# Altium project Panel 1.PrjPcb
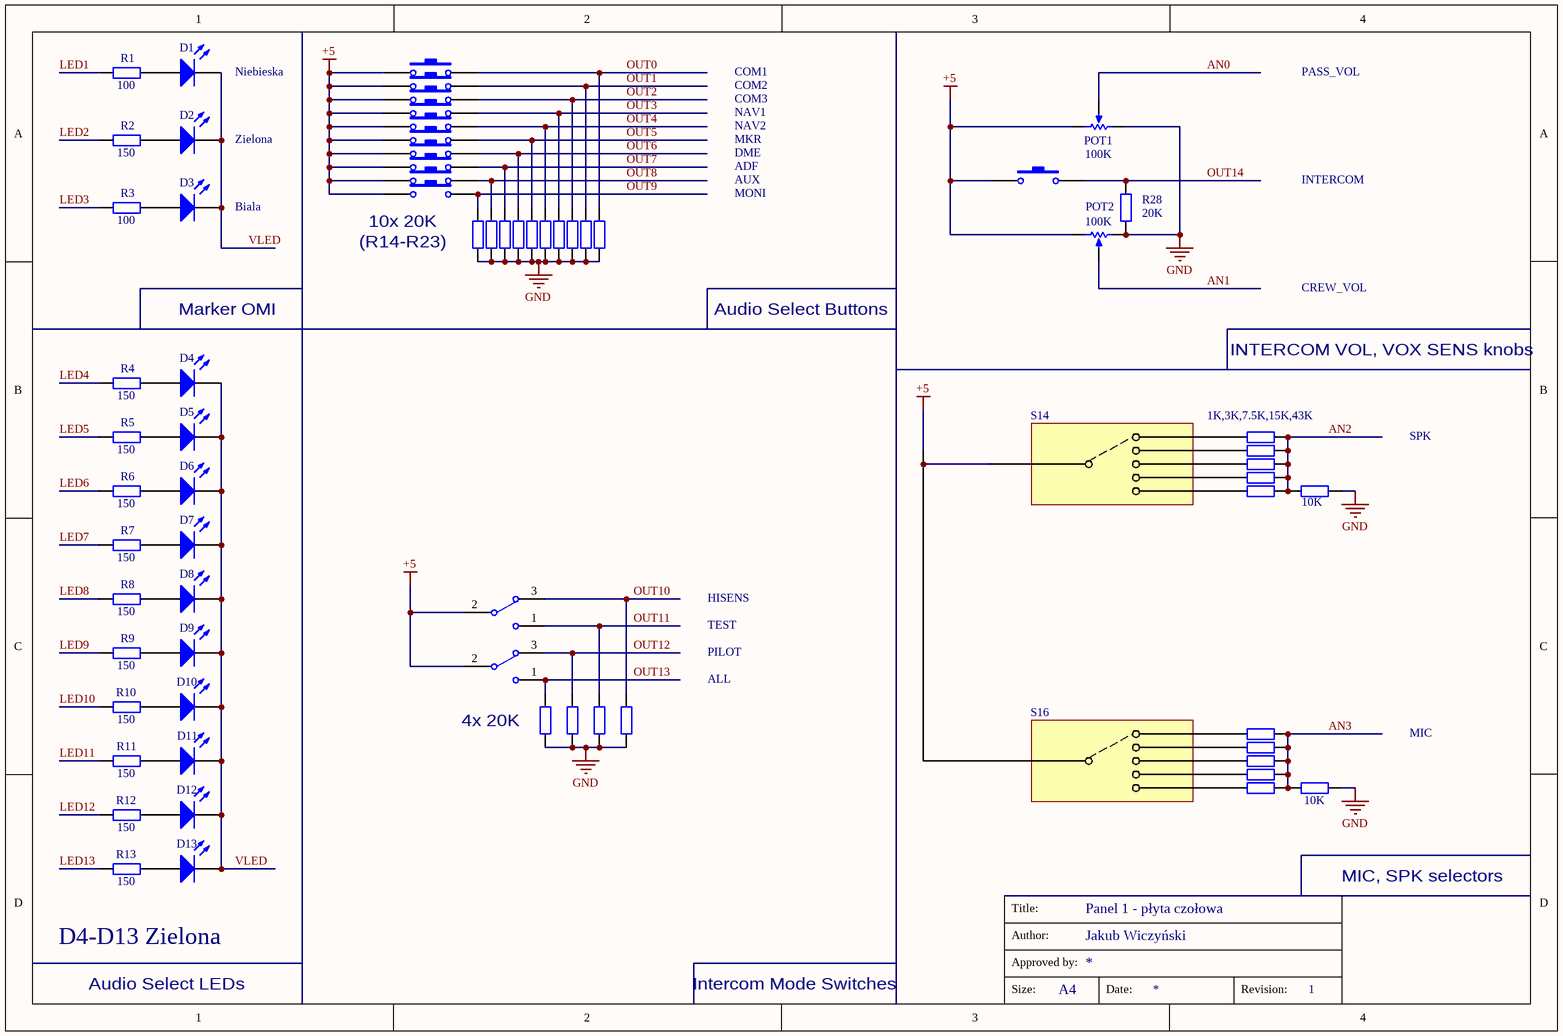
[diagram p0: Panel.SchDoc]
5 sheets, 124 parts. Net scope: global (net labels, ports and power ports of the same name join across sheets).
Board file: Panel 1.PcbDoc
Sheets:
  Panel.SchDoc
  Driving.SchDoc
  PISO.SchDoc
  SIPO.SchDoc
  sterownik.SchDoc

## Sheet Panel.SchDoc: Panel 1 - płyta czołowa
size A4; Author: Jakub Wiczyński; Revision: 1

### Parts
D1  http://www.tme.eu/pl/details/of-smd3216b/diody-led-smd-kolorowe/optoflash/  [Dioda SMD 1206 Niebieska]  (value not drawn)
D2  http://www.tme.eu/pl/details/of-smd3216yg-rv/diody-led-smd-kolorowe/optoflash/  [Dioda SMD 1206 Zielona]  (value not drawn)
D3  http://www.tme.eu/pl/details/ltw-150tk/diody-led-smd-biale/liteon/  [Dioda SMD 1206 Biala]  (value not drawn)
D4  http://www.tme.eu/pl/details/of-smd3216yg-rv/diody-led-smd-kolorowe/optoflash/  [Dioda SMD 1206 Zielona]  (value not drawn)
D5  http://www.tme.eu/pl/details/of-smd3216yg-rv/diody-led-smd-kolorowe/optoflash/  [Dioda SMD 1206 Zielona]  (value not drawn)
D6  http://www.tme.eu/pl/details/of-smd3216yg-rv/diody-led-smd-kolorowe/optoflash/  [Dioda SMD 1206 Zielona]  (value not drawn)
D7  http://www.tme.eu/pl/details/of-smd3216yg-rv/diody-led-smd-kolorowe/optoflash/  [Dioda SMD 1206 Zielona]  (value not drawn)
D8  http://www.tme.eu/pl/details/of-smd3216yg-rv/diody-led-smd-kolorowe/optoflash/  [Dioda SMD 1206 Zielona]  (value not drawn)
D9  http://www.tme.eu/pl/details/of-smd3216yg-rv/diody-led-smd-kolorowe/optoflash/  [Dioda SMD 1206 Zielona]  (value not drawn)
D10  http://www.tme.eu/pl/details/of-smd3216yg-rv/diody-led-smd-kolorowe/optoflash/  [Dioda SMD 1206 Zielona]  (value not drawn)
D11  http://www.tme.eu/pl/details/of-smd3216yg-rv/diody-led-smd-kolorowe/optoflash/  [Dioda SMD 1206 Zielona]  (value not drawn)
D12  http://www.tme.eu/pl/details/of-smd3216yg-rv/diody-led-smd-kolorowe/optoflash/  [Dioda SMD 1206 Zielona]  (value not drawn)
D13  http://www.tme.eu/pl/details/of-smd3216yg-rv/diody-led-smd-kolorowe/optoflash/  [Dioda SMD 1206 Zielona]  (value not drawn)
POT1  value 100K  [Potentiometer]  (hidden comment: http://www.tme.eu/pl/details/pcw1j-c24-bab104l/potencjometry-jednoobrz-przew-plastiku/bourns/)
POT2  value 100K  [Potentiometer]  (hidden comment: http://www.tme.eu/pl/details/pcw1j-c24-bab104l/potencjometry-jednoobrz-przew-plastiku/bourns/)
R1  value 100  [C1206]  (hidden comment: http://www.tme.eu/pl/details/crcw1206100rfktabc/rezystory-smd-1206/vishay/)
R2  value 150  [C1206]  (hidden comment: http://www.tme.eu/pl/details/crcw1206150rfktabc/rezystory-smd-1206/vishay/)
R3  value 100  [C1206]  (hidden comment: http://www.tme.eu/pl/details/crcw1206100rfktabc/rezystory-smd-1206/vishay/)
R4  value 150  [C1206]  (hidden comment: http://www.tme.eu/pl/details/crcw1206150rfktabc/rezystory-smd-1206/vishay/)
R5  value 150  [C1206]  (hidden comment: http://www.tme.eu/pl/details/crcw1206150rfktabc/rezystory-smd-1206/vishay/)
R6  value 150  [C1206]  (hidden comment: http://www.tme.eu/pl/details/crcw1206150rfktabc/rezystory-smd-1206/vishay/)
R7  value 150  [C1206]  (hidden comment: http://www.tme.eu/pl/details/crcw1206150rfktabc/rezystory-smd-1206/vishay/)
R8  value 150  [C1206]  (hidden comment: http://www.tme.eu/pl/details/crcw1206150rfktabc/rezystory-smd-1206/vishay/)
R9  value 150  [C1206]  (hidden comment: http://www.tme.eu/pl/details/crcw1206150rfktabc/rezystory-smd-1206/vishay/)
R10  value 150  [C1206]  (hidden comment: http://www.tme.eu/pl/details/crcw1206150rfktabc/rezystory-smd-1206/vishay/)
R11  value 150  [C1206]  (hidden comment: http://www.tme.eu/pl/details/crcw1206150rfktabc/rezystory-smd-1206/vishay/)
R12  value 150  [C1206]  (hidden comment: http://www.tme.eu/pl/details/crcw1206150rfktabc/rezystory-smd-1206/vishay/)
R13  value 150  [C1206]  (hidden comment: http://www.tme.eu/pl/details/crcw1206150rfktabc/rezystory-smd-1206/vishay/)
R14  http://www.tme.eu/pl/details/crcw120620k0fktabc/rezystory-smd-1206/vishay/  [C1206]  (value not drawn)
R15  http://www.tme.eu/pl/details/crcw120620k0fktabc/rezystory-smd-1206/vishay/  [C1206]  (value not drawn)
R16  http://www.tme.eu/pl/details/crcw120620k0fktabc/rezystory-smd-1206/vishay/  [C1206]  (value not drawn)
R17  http://www.tme.eu/pl/details/crcw120620k0fktabc/rezystory-smd-1206/vishay/  [C1206]  (value not drawn)
R18  http://www.tme.eu/pl/details/crcw120620k0fktabc/rezystory-smd-1206/vishay/  [C1206]  (value not drawn)
R19  http://www.tme.eu/pl/details/crcw120620k0fktabc/rezystory-smd-1206/vishay/  [C1206]  (value not drawn)
R20  http://www.tme.eu/pl/details/crcw120620k0fktabc/rezystory-smd-1206/vishay/  [C1206]  (value not drawn)
R21  http://www.tme.eu/pl/details/crcw120620k0fktabc/rezystory-smd-1206/vishay/  [C1206]  (value not drawn)
R22  http://www.tme.eu/pl/details/crcw120620k0fktabc/rezystory-smd-1206/vishay/  [C1206]  (value not drawn)
R23  http://www.tme.eu/pl/details/crcw120620k0fktabc/rezystory-smd-1206/vishay/  [C1206]  (value not drawn)
R24  http://www.tme.eu/pl/details/crcw120620k0fktabc/rezystory-smd-1206/vishay/  [C1206]  (value not drawn)
R25  http://www.tme.eu/pl/details/crcw120620k0fktabc/rezystory-smd-1206/vishay/  [C1206]  (value not drawn)
R26  http://www.tme.eu/pl/details/crcw120620k0fktabc/rezystory-smd-1206/vishay/  [C1206]  (value not drawn)
R27  http://www.tme.eu/pl/details/crcw120620k0fktabc/rezystory-smd-1206/vishay/  [C1206]  (value not drawn)
R28  value 20K  [C1206]  (hidden comment: http://www.tme.eu/pl/details/crcw120620k0fktabc/rezystory-smd-1206/vishay/)
R29  http://www.tme.eu/pl/details/crcw12061k00fkea/rezystory-smd-1206/vishay/  [C1206]  (value not drawn)
R30  http://www.tme.eu/pl/details/crcw12063k00fktabc/rezystory-smd-1206/vishay/  [C1206]  (value not drawn)
R31  http://www.tme.eu/pl/details/crcw12067k50fktabc/rezystory-smd-1206/vishay/  [C1206]  (value not drawn)
R32  http://www.tme.eu/pl/details/crcw120615k0jntabc/rezystory-smd-1206/vishay/  [C1206]  (value not drawn)
R33  http://www.tme.eu/pl/details/rc1206jr-0743k/rezystory-smd-1206/yageo/rc1206jr-0743kl/  [C1206]  (value not drawn)
R34  value 10K  [C1206]  (hidden comment: http://www.tme.eu/pl/details/crcw120610k0jntabc/rezystory-smd-1206/vishay/)
R36  http://www.tme.eu/pl/details/crcw12061k00fkea/rezystory-smd-1206/vishay/  [C1206]  (value not drawn)
R37  http://www.tme.eu/pl/details/crcw12063k00fktabc/rezystory-smd-1206/vishay/  [C1206]  (value not drawn)
R38  http://www.tme.eu/pl/details/crcw12067k50fktabc/rezystory-smd-1206/vishay/  [C1206]  (value not drawn)
R39  http://www.tme.eu/pl/details/crcw120615k0jntabc/rezystory-smd-1206/vishay/  [C1206]  (value not drawn)
R40  http://www.tme.eu/pl/details/rc1206jr-0743k/rezystory-smd-1206/yageo/rc1206jr-0743kl/  [C1206]  (value not drawn)
R41  value 10K  [C1206]  (hidden comment: http://www.tme.eu/pl/details/crcw120610k0jntabc/rezystory-smd-1206/vishay/)
S1  http://www.tme.eu/pl/details/1301.9315/mikroprzelaczniki-tact-pcb/schurter/  [Microswitch_SMD]  (value not drawn)
S2  http://www.tme.eu/pl/details/1301.9315/mikroprzelaczniki-tact-pcb/schurter/  [Microswitch_SMD]  (value not drawn)
S3  http://www.tme.eu/pl/details/1301.9315/mikroprzelaczniki-tact-pcb/schurter/  [Microswitch_SMD]  (value not drawn)
S4  http://www.tme.eu/pl/details/1301.9315/mikroprzelaczniki-tact-pcb/schurter/  [Microswitch_SMD]  (value not drawn)
S5  http://www.tme.eu/pl/details/1301.9315/mikroprzelaczniki-tact-pcb/schurter/  [Microswitch_SMD]  (value not drawn)
S6  http://www.tme.eu/pl/details/1301.9315/mikroprzelaczniki-tact-pcb/schurter/  [Microswitch_SMD]  (value not drawn)
S7  http://www.tme.eu/pl/details/1301.9315/mikroprzelaczniki-tact-pcb/schurter/  [Microswitch_SMD]  (value not drawn)
S8  http://www.tme.eu/pl/details/1301.9315/mikroprzelaczniki-tact-pcb/schurter/  [Microswitch_SMD]  (value not drawn)
S9  http://www.tme.eu/pl/details/1301.9315/mikroprzelaczniki-tact-pcb/schurter/  [Microswitch_SMD]  (value not drawn)
S10  http://www.tme.eu/pl/details/1301.9315/mikroprzelaczniki-tact-pcb/schurter/  [Microswitch_SMD]  (value not drawn)
S11  http://www.tme.eu/pl/details/1ms3t1b1m1qe/przelaczniki-dzwigniowe/ninigi/  [3POS SWITCH]  (value not drawn)
S12  http://www.tme.eu/pl/details/1ms3t1b1m1qe/przelaczniki-dzwigniowe/ninigi/  [3POS SWITCH]  (value not drawn)
S13  http://www.tme.eu/pl/details/1301.9315/mikroprzelaczniki-tact-pcb/schurter/  [Microswitch_SMD]  (value not drawn)
S14  http://www.tme.eu/pl/details/sr2611515fn/przelaczniki-obrotowe/ninigi/  [ROT SW]  (value not drawn)
S16  http://www.tme.eu/pl/details/sr2611515fn/przelaczniki-obrotowe/ninigi/  [ROT SW]  (value not drawn)

### Nets
+5: POT1.2(BOT) POT2.1(TOP) S1.1 S2.1 S3.1 S4.1 S5.1 S6.1 S7.1 S8.1 S9.1 S10.1 S11.2 S12.2 S13.1 S14.1 S16.1
GND: POT1.1(TOP) POT2.2(BOT) R14.1 R15.1 R16.1 R17.1 R18.1 R19.1 R20.1 R21.1 R22.1 R23.1 R24.1 R25.1 R26.1 R27.1 R28.2 R34.1 R41.1
AN0: POT1.3(TAP)
AN1: POT2.3(TAP)
AN2: R29.2 R30.2 R31.2 R32.2 R33.2 R34.2
AN3: R36.2 R37.2 R38.2 R39.2 R40.2 R41.2
LED1: R1.1
LED2: R2.1
LED3: R3.1
LED4: R4.1
LED5: R5.1
LED6: R6.1
LED7: R7.1
LED8: R8.1
LED9: R9.1
LED10: R10.1
LED11: R11.1
LED12: R12.1
LED13: R13.1
OUT0: R23.2 S1.2
OUT1: R22.2 S2.2
OUT2: R21.2 S3.2
OUT3: R20.2 S4.2
OUT4: R19.2 S5.2
OUT5: R18.2 S6.2
OUT6: R17.2 S7.2
OUT7: R16.2 S8.2
OUT8: R15.2 S9.2
OUT9: R14.2 S10.2
OUT10: R27.2 S11.3
OUT11: R26.2 S11.1
OUT12: R25.2 S12.3
OUT13: R24.2 S12.1
OUT14: R28.1 S13.2
VLED: D1.2(K) D2.2(K) D3.2(K) D4.2(K) D5.2(K) D6.2(K) D7.2(K) D8.2(K) D9.2(K) D10.2(K) D11.2(K) D12.2(K) D13.2(K)
NetD1_1: D1.1(A) R1.2
NetD2_1: D2.1(A) R2.2
NetD3_1: D3.1(A) R3.2
NetD4_1: D4.1(A) R4.2
NetD5_1: D5.1(A) R5.2
NetD6_1: D6.1(A) R6.2
NetD7_1: D7.1(A) R7.2
NetD8_1: D8.1(A) R8.2
NetD9_1: D9.1(A) R9.2
NetD10_1: D10.1(A) R10.2
NetD11_1: D11.1(A) R11.2
NetD12_1: D12.1(A) R12.2
NetD13_1: D13.1(A) R13.2
NetR29_1: R29.1 S14.2
NetR30_1: R30.1 S14.3
NetR31_1: R31.1 S14.4
NetR32_1: R32.1 S14.5
NetR33_1: R33.1 S14.6
NetR36_1: R36.1 S16.2
NetR37_1: R37.1 S16.3
NetR38_1: R38.1 S16.4
NetR39_1: R39.1 S16.5
NetR40_1: R40.1 S16.6

### Notes on the sheet
- (near D1) Niebieska
- COM1
- COM2
- COM3
- NAV1
- PASS_VOL
- (near D2) Zielona
- NAV2
- MKR
- DME
- ADF
- (near D3) Biala
- (near S10) 10x 20K
- (R14-R23)
- AUX
- MONI
- INTERCOM
- Marker OMI
- Audio Select Buttons
- CREW_VOL
- INTERCOM VOL, VOX SENS knobs
- 1K,3K,7.5K,15K,43K
- SPK
- HISENS
- TEST
- PILOT
- 4x 20K
- ALL
- MIC
- MIC, SPK selectors
- D4-D13 Zielona
- Audio Select LEDs
- Intercom Mode Switches
- Title:
- Author:
- Approved by:
- Size:
- A4
- Date:
- Revision:

### Library data of the parts
D1 = LED0: LED SMD Niebieska; Published: 8-Jun-2000; LatestRevisionDate: 08-Jul-2005; LatestRevisionNote: Mech Layer 1 removed.; PackageReference: LED-0; Publisher: Altium Limited; PackageDescription: LED; 2 Leads
D2 D4-D13 = LED0: LED SMD Zielona; Published: 8-Jun-2000; LatestRevisionDate: 08-Jul-2005; LatestRevisionNote: Mech Layer 1 removed.; PackageReference: LED-0; Publisher: Altium Limited; PackageDescription: LED; 2 Leads
D3 = LED0: LED SMD Biala; Published: 8-Jun-2000; LatestRevisionDate: 08-Jul-2005; LatestRevisionNote: Mech Layer 1 removed.; PackageReference: LED-0; Publisher: Altium Limited; PackageDescription: LED; 2 Leads
POT1 POT2 = RPot: Potencjometr 100K; pin to pad: 1>3 2>1 3>2; Sim Note: Enter the Resistance value and the set point into parameter fields.; Set Position: 0.5; Published: 8-Jun-2000; LatestRevisionDate: 17-Jul-2002; LatestRevisionNote: Re-released for DXP Platform.; PackageReference: VR5; Publisher: Altium Limited; PackageDescription: Variable Resistor, Thru-Hole; 3 Leads
R1 R3 = Res2: 100R; Published: 8-Jun-2000; LatestRevisionDate: 17-Jul-2002; LatestRevisionNote: Re-released for DXP Platform.; PackageReference: AXIAL-0.4; Publisher: Altium Limited; PackageDescription: Axial Device, Thru-Hole; 2 Leads; 0.4 in Pin Spacing
R2 R4-R13 = Res2: 150R; Published: 8-Jun-2000; LatestRevisionDate: 17-Jul-2002; LatestRevisionNote: Re-released for DXP Platform.; PackageReference: AXIAL-0.4; Publisher: Altium Limited; PackageDescription: Axial Device, Thru-Hole; 2 Leads; 0.4 in Pin Spacing
R14-R28 = Res2: 20K; Published: 8-Jun-2000; LatestRevisionDate: 17-Jul-2002; LatestRevisionNote: Re-released for DXP Platform.; PackageReference: AXIAL-0.4; Publisher: Altium Limited; PackageDescription: Axial Device, Thru-Hole; 2 Leads; 0.4 in Pin Spacing
  R14-R27: Value: 20K
R29 R36 = Res2: 1K; Published: 8-Jun-2000; LatestRevisionDate: 17-Jul-2002; LatestRevisionNote: Re-released for DXP Platform.; PackageReference: AXIAL-0.4; Publisher: Altium Limited; PackageDescription: Axial Device, Thru-Hole; 2 Leads; 0.4 in Pin Spacing; Value: 1K
R30 R37 = Res2: 3K; Published: 8-Jun-2000; LatestRevisionDate: 17-Jul-2002; LatestRevisionNote: Re-released for DXP Platform.; PackageReference: AXIAL-0.4; Publisher: Altium Limited; PackageDescription: Axial Device, Thru-Hole; 2 Leads; 0.4 in Pin Spacing; Value: 3K
R31 R38 = Res2: 7.5K; Published: 8-Jun-2000; LatestRevisionDate: 17-Jul-2002; LatestRevisionNote: Re-released for DXP Platform.; PackageReference: AXIAL-0.4; Publisher: Altium Limited; PackageDescription: Axial Device, Thru-Hole; 2 Leads; 0.4 in Pin Spacing; Value: 7.5K
R32 R39 = Res2: 15K; Published: 8-Jun-2000; LatestRevisionDate: 17-Jul-2002; LatestRevisionNote: Re-released for DXP Platform.; PackageReference: AXIAL-0.4; Publisher: Altium Limited; PackageDescription: Axial Device, Thru-Hole; 2 Leads; 0.4 in Pin Spacing; Value: 15K
R33 R40 = Res2: 43K; Published: 8-Jun-2000; LatestRevisionDate: 17-Jul-2002; LatestRevisionNote: Re-released for DXP Platform.; PackageReference: AXIAL-0.4; Publisher: Altium Limited; PackageDescription: Axial Device, Thru-Hole; 2 Leads; 0.4 in Pin Spacing; Value: 43K
R34 R41 = Res2: 10K; Published: 8-Jun-2000; LatestRevisionDate: 17-Jul-2002; LatestRevisionNote: Re-released for DXP Platform.; PackageReference: AXIAL-0.4; Publisher: Altium Limited; PackageDescription: Axial Device, Thru-Hole; 2 Leads; 0.4 in Pin Spacing
S1-S10 S13 = SW-PB: Microswitch (SPST); pin to pad: 2>3; Published: 24-Mar-1999; LatestRevisionDate: 17-Jul-2002; LatestRevisionNote: Re-released for DXP Platform.; PackageReference: SPST-2; Publisher: Altium Limited; PackageDescription: Switch; 2 Leads
S11 S12 = SW-SPDT: Przelacznik SP3T; Published: 24-Mar-1999; LatestRevisionDate: 17-Dec-2003; LatestRevisionNote: Schematic revised, PCB Footprint replaced.; DatasheetVersion: 05-Dec-2000; PackageReference: TL36WW15050; Publisher: Altium Limited; PackageDescription: Switch; 4 Leads; ComponentLink1Description: Manufacturer Link; ComponentLink1URL: http://www.apem.com
S14 S16 = 5SW: Przelacznik obrotowy 5-pozycyjny; pin to pad: 1>A 2>1 3>2 4>3 5>4 6>5

## Sheet Driving.SchDoc: Sterowanie LED
size A4; Author: Jakub Wiczynski; Organization: Simle; Revision: 1; ProjectName: Symulator
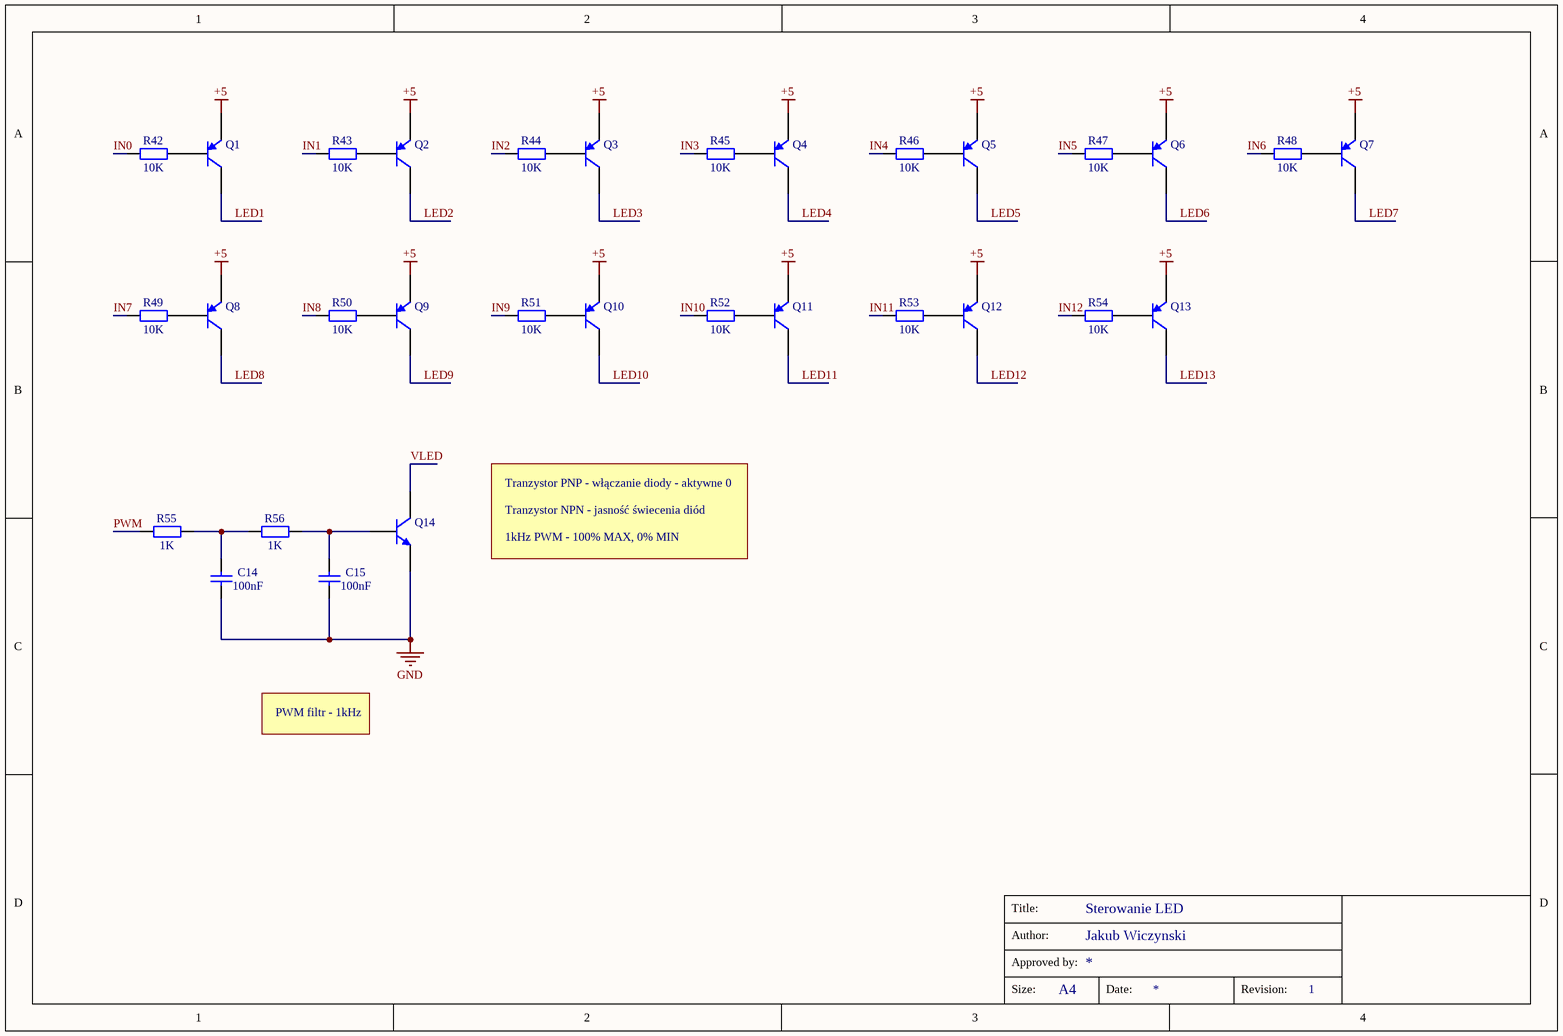
[diagram p1: Driving.SchDoc]

### Parts
C14  value 100nF  [C1206]  (hidden comment: http://www.tme.eu/pl/details/12061c104kat2a/kondensatory-mlcc-smd-1206/avx/)
C15  value 100nF  [C1206]  (hidden comment: http://www.tme.eu/pl/details/12061c104kat2a/kondensatory-mlcc-smd-1206/avx/)
Q1  http://www.tme.eu/pl/details/bc856a/tranzystory-pnp-smd/nexperia/bc856a215/  [SOT-23B_N]  (value not drawn)
Q2  http://www.tme.eu/pl/details/bc856a/tranzystory-pnp-smd/nexperia/bc856a215/  [SOT-23B_N]  (value not drawn)
Q3  http://www.tme.eu/pl/details/bc856a/tranzystory-pnp-smd/nexperia/bc856a215/  [SOT-23B_N]  (value not drawn)
Q4  http://www.tme.eu/pl/details/bc856a/tranzystory-pnp-smd/nexperia/bc856a215/  [SOT-23B_N]  (value not drawn)
Q5  http://www.tme.eu/pl/details/bc856a/tranzystory-pnp-smd/nexperia/bc856a215/  [SOT-23B_N]  (value not drawn)
Q6  http://www.tme.eu/pl/details/bc856a/tranzystory-pnp-smd/nexperia/bc856a215/  [SOT-23B_N]  (value not drawn)
Q7  http://www.tme.eu/pl/details/bc856a/tranzystory-pnp-smd/nexperia/bc856a215/  [SOT-23B_N]  (value not drawn)
Q8  http://www.tme.eu/pl/details/bc856a/tranzystory-pnp-smd/nexperia/bc856a215/  [SOT-23B_N]  (value not drawn)
Q9  http://www.tme.eu/pl/details/bc856a/tranzystory-pnp-smd/nexperia/bc856a215/  [SOT-23B_N]  (value not drawn)
Q10  http://www.tme.eu/pl/details/bc856a/tranzystory-pnp-smd/nexperia/bc856a215/  [SOT-23B_N]  (value not drawn)
Q11  http://www.tme.eu/pl/details/bc856a/tranzystory-pnp-smd/nexperia/bc856a215/  [SOT-23B_N]  (value not drawn)
Q12  http://www.tme.eu/pl/details/bc856a/tranzystory-pnp-smd/nexperia/bc856a215/  [SOT-23B_N]  (value not drawn)
Q13  http://www.tme.eu/pl/details/bc856a/tranzystory-pnp-smd/nexperia/bc856a215/  [SOT-23B_N]  (value not drawn)
Q14  http://www.tme.eu/pl/details/bc817-16.215/tranzystory-npn-smd/nexperia/  [SOT-23B_N]  (value not drawn)
R42  value 10K  [C1206]  (hidden comment: http://www.tme.eu/pl/details/crcw120610k0jntabc/rezystory-smd-1206/vishay/)
R43  value 10K  [C1206]  (hidden comment: http://www.tme.eu/pl/details/crcw120610k0jntabc/rezystory-smd-1206/vishay/)
R44  value 10K  [C1206]  (hidden comment: http://www.tme.eu/pl/details/crcw120610k0jntabc/rezystory-smd-1206/vishay/)
R45  value 10K  [C1206]  (hidden comment: http://www.tme.eu/pl/details/crcw120610k0jntabc/rezystory-smd-1206/vishay/)
R46  value 10K  [C1206]  (hidden comment: http://www.tme.eu/pl/details/crcw120610k0jntabc/rezystory-smd-1206/vishay/)
R47  value 10K  [C1206]  (hidden comment: http://www.tme.eu/pl/details/crcw120610k0jntabc/rezystory-smd-1206/vishay/)
R48  value 10K  [C1206]  (hidden comment: http://www.tme.eu/pl/details/crcw120610k0jntabc/rezystory-smd-1206/vishay/)
R49  value 10K  [C1206]  (hidden comment: http://www.tme.eu/pl/details/crcw120610k0jntabc/rezystory-smd-1206/vishay/)
R50  value 10K  [C1206]  (hidden comment: http://www.tme.eu/pl/details/crcw120610k0jntabc/rezystory-smd-1206/vishay/)
R51  value 10K  [C1206]  (hidden comment: http://www.tme.eu/pl/details/crcw120610k0jntabc/rezystory-smd-1206/vishay/)
R52  value 10K  [C1206]  (hidden comment: http://www.tme.eu/pl/details/crcw120610k0jntabc/rezystory-smd-1206/vishay/)
R53  value 10K  [C1206]  (hidden comment: http://www.tme.eu/pl/details/crcw120610k0jntabc/rezystory-smd-1206/vishay/)
R54  value 10K  [C1206]  (hidden comment: http://www.tme.eu/pl/details/crcw120610k0jntabc/rezystory-smd-1206/vishay/)
R55  value 1K  [C1206]  (hidden comment: http://www.tme.eu/pl/details/crcw12061k00fkea/rezystory-smd-1206/vishay/)
R56  value 1K  [C1206]  (hidden comment: http://www.tme.eu/pl/details/crcw12061k00fkea/rezystory-smd-1206/vishay/)

### Nets
+5: Q1.3(E) Q2.3(E) Q3.3(E) Q4.3(E) Q5.3(E) Q6.3(E) Q7.3(E) Q8.3(E) Q9.3(E) Q10.3(E) Q11.3(E) Q12.3(E) Q13.3(E)
GND: C14.1 C15.1 Q14.3(E)
IN0: R42.1
IN1: R43.1
IN2: R44.1
IN3: R45.1
IN4: R46.1
IN5: R47.1
IN6: R48.1
IN7: R49.1
IN8: R50.1
IN9: R51.1
IN10: R52.1
IN11: R53.1
IN12: R54.1
LED1: Q1.1(C)
LED2: Q2.1(C)
LED3: Q3.1(C)
LED4: Q4.1(C)
LED5: Q5.1(C)
LED6: Q6.1(C)
LED7: Q7.1(C)
LED8: Q8.1(C)
LED9: Q9.1(C)
LED10: Q10.1(C)
LED11: Q11.1(C)
LED12: Q12.1(C)
LED13: Q13.1(C)
PWM: R55.1
VLED: Q14.1(C)
NetC14_2: C14.2 R55.2 R56.1
NetC15_2: C15.2 Q14.2(B) R56.2
NetQ1_2: Q1.2(B) R42.2
NetQ2_2: Q2.2(B) R43.2
NetQ3_2: Q3.2(B) R44.2
NetQ4_2: Q4.2(B) R45.2
NetQ5_2: Q5.2(B) R46.2
NetQ6_2: Q6.2(B) R47.2
NetQ7_2: Q7.2(B) R48.2
NetQ8_2: Q8.2(B) R49.2
NetQ9_2: Q9.2(B) R50.2
NetQ10_2: Q10.2(B) R51.2
NetQ11_2: Q11.2(B) R52.2
NetQ12_2: Q12.2(B) R53.2
NetQ13_2: Q13.2(B) R54.2

### Notes on the sheet
- Tranzystor PNP - włączanie diody - aktywne 0
- Tranzystor NPN - jasność świecenia diód
- 1kHz PWM - 100% MAX, 0% MIN
- PWM filtr - 1kHz
- Title:
- Author:
- Approved by:
- Size:
- A4
- Date:
- Revision:

### Library data of the parts
C14 C15 = Cap: 100nF; Published: 8-Jun-2000; LatestRevisionDate: 17-Jul-2002; LatestRevisionNote: Re-released for DXP Platform.; PackageReference: RAD-0.3; Publisher: Altium Limited; PackageDescription: Radial Cap, Thru-Hole; 2 Leads; 0.3 in Pin Spacing
Q1-Q13 = PNP: PNP 100mA; Published: 8-Jun-2000; LatestRevisionDate: 29-May-2009; LatestRevisionNote: IPC-7351 Footprint Added.; PackageVersion: Aug-1999; PackageReference: SOT-23B; Publisher: Altium Limited; PackageDescription: 3-Pin SOT-23 Package 0.95 mm Pitch, 2.4 mm Lead Span
Q14 = NPN: NPN 500mA; Published: 8-Jun-2000; LatestRevisionDate: 17-Jul-2002; LatestRevisionNote: Re-released for DXP Platform.; PackageReference: TO-226-AA; Publisher: Altium Limited; PackageDescription: TO, Flat Index; 3 In-Line, Axial Leads; Body Dia. 4.8mm; Leads 0.55 x 0.51 mm (max); Code_JEDEC: TO-226-AA
R42-R54 = Res2: 10K; Published: 8-Jun-2000; LatestRevisionDate: 17-Jul-2002; LatestRevisionNote: Re-released for DXP Platform.; PackageReference: AXIAL-0.4; Publisher: Altium Limited; PackageDescription: Axial Device, Thru-Hole; 2 Leads; 0.4 in Pin Spacing
R55 R56 = Res2: 1K; Published: 8-Jun-2000; LatestRevisionDate: 17-Jul-2002; LatestRevisionNote: Re-released for DXP Platform.; PackageReference: AXIAL-0.4; Publisher: Altium Limited; PackageDescription: Axial Device, Thru-Hole; 2 Leads; 0.4 in Pin Spacing

## Sheet PISO.SchDoc: Rejestry PISO
size A4; Author: Jakub Wiczynski; Revision: 1
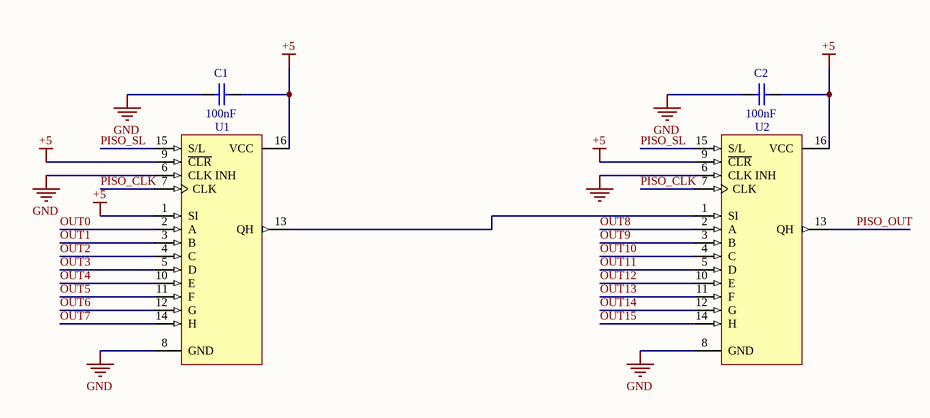
[diagram p2: PISO.SchDoc]

### Parts
C1  value 100nF  [C1206]  (hidden comment: http://www.tme.eu/pl/details/12061c104kat2a/kondensatory-mlcc-smd-1206/avx/)
C2  value 100nF  [C1206]  (hidden comment: http://www.tme.eu/pl/details/12061c104kat2a/kondensatory-mlcc-smd-1206/avx/)
U1  http://www.tme.eu/pl/details/sn74hc166d/rejestry-przesuwne/texas-instruments/  [D016_N]  (value not drawn)
U2  http://www.tme.eu/pl/details/sn74hc166d/rejestry-przesuwne/texas-instruments/  [D016_N]  (value not drawn)

### Nets
+5: C1.2 C2.2 U1.1(SI) U1.9(~{CLR}) U1.16(VCC) U2.9(~{CLR}) U2.16(VCC)
GND: C1.1 C2.1 U1.6(CLK_INH) U1.8(GND) U2.6(CLK_INH) U2.8(GND)
OUT0: U1.2(A)
OUT1: U1.3(B)
OUT2: U1.4(C)
OUT3: U1.5(D)
OUT4: U1.10(E)
OUT5: U1.11(F)
OUT6: U1.12(G)
OUT7: U1.14(H)
OUT8: U2.2(A)
OUT9: U2.3(B)
OUT10: U2.4(C)
OUT11: U2.5(D)
OUT12: U2.10(E)
OUT13: U2.11(F)
OUT14: U2.12(G)
OUT15: U2.14(H)
PISO_CLK: U1.7(CLK) U2.7(CLK)
PISO_OUT: U2.13(QH)
PISO_SL: U1.15(S/L) U2.15(S/L)
NetU1_13: U1.13(QH) U2.1(SI)

### Notes on the sheet
- Title:
- Author:
- Approved by:
- Size:
- A4
- Date:
- Revision:

### Library data of the parts
C1 C2 = Cap: 100nF; Published: 8-Jun-2000; LatestRevisionDate: 17-Jul-2002; LatestRevisionNote: Re-released for DXP Platform.; PackageReference: RAD-0.3; Publisher: Altium Limited; PackageDescription: Radial Cap, Thru-Hole; 2 Leads; 0.3 in Pin Spacing
U1 U2 = SN74HC166D: SN74HC166; Published: 8-Jun-2000; LatestRevisionDate: 13-Apr-2006; LatestRevisionNote: IPC-7351 Footprint Added.; DatasheetVersion: May-1997; PackageVersion: Jan-1998; PackageReference: D016; Publisher: Altium Limited; PackageDescription: 16-Pin Small Outline Integrated Circuit 1.27 mm Pitch; Code_IPC: SOIC127P600-16; ComponentLink1Description: Manufacturer Link; ComponentLink1URL: http://www.ti.com/; ComponentLink2Description: Datasheet; ComponentLink2URL: http://www-s.ti.com/sc/ds/sn74hc166.pdf

## Sheet SIPO.SchDoc: Rejestry SIPO
size A4; Author: Jakub Wiczynski; Revision: 1
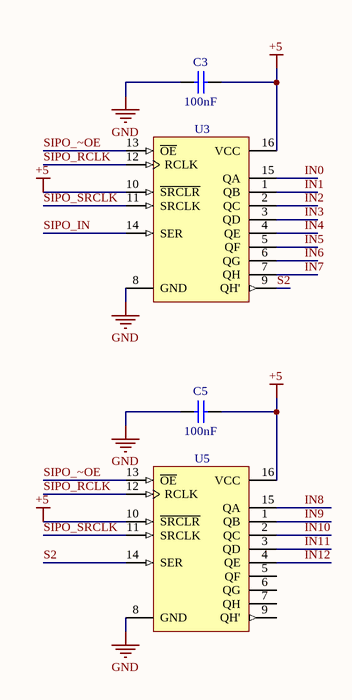
[diagram p3: SIPO.SchDoc]

### Parts
C3  value 100nF  [C1206]  (hidden comment: http://www.tme.eu/pl/details/12061c104kat2a/kondensatory-mlcc-smd-1206/avx/)
C5  value 100nF  [C1206]  (hidden comment: http://www.tme.eu/pl/details/12061c104kat2a/kondensatory-mlcc-smd-1206/avx/)
U3  http://www.tme.eu/pl/details/sn74hc595d/rejestry-przesuwne/texas-instruments/  [SOIC16_N]  (value not drawn)
U5  http://www.tme.eu/pl/details/sn74hc595d/rejestry-przesuwne/texas-instruments/  [SOIC16_N]  (value not drawn)

### Nets
+5: C3.2 C5.2 U3.10(~{SRCLR}) U3.16(VCC) U5.10(~{SRCLR}) U5.16(VCC)
GND: C3.1 C5.1 U3.8(GND) U5.8(GND)
IN0: U3.15(QA)
IN1: U3.1(QB)
IN2: U3.2(QC)
IN3: U3.3(QD)
IN4: U3.4(QE)
IN5: U3.5(QF)
IN6: U3.6(QG)
IN7: U3.7(QH)
IN8: U5.15(QA)
IN9: U5.1(QB)
IN10: U5.2(QC)
IN11: U5.3(QD)
IN12: U5.4(QE)
S2: U3.9(QH') U5.14(SER)
SIPO_IN: U3.14(SER)
SIPO_RCLK: U3.12(RCLK) U5.12(RCLK)
SIPO_SRCLK: U3.11(SRCLK) U5.11(SRCLK)
SIPO_~OE: U3.13(~{OE}) U5.13(~{OE})

Not connected (* = marked no-connect by the designer): U5 5(QF) 6(QG) 7(QH) 9(QH')

### Notes on the sheet
- Title:
- Author:
- Approved by:
- Size:
- A4
- Date:
- Revision:

### Library data of the parts
C3 C5 = Cap: 100nF; Published: 8-Jun-2000; LatestRevisionDate: 17-Jul-2002; LatestRevisionNote: Re-released for DXP Platform.; PackageReference: RAD-0.3; Publisher: Altium Limited; PackageDescription: Radial Cap, Thru-Hole; 2 Leads; 0.3 in Pin Spacing
U3 U5 = SN74HC595N: SN74HC595; Published: 8-Jun-2000; LatestRevisionDate: 04-Mar-2005; LatestRevisionNote: Stylized 3D Model Added.; DatasheetVersion: May-1997; PackageVersion: Oct-1995; PackageReference: N016; Publisher: Altium Limited; PackageDescription: DIP; 16 Leads; Row Spacing 7.62 mm; Pitch 2.54 mm; Code_JEDEC: MS-001-BB; ComponentLink1Description: Manufacturer Link; ComponentLink1URL: http://www.ti.com/; ComponentLink2Description: Datasheet; ComponentLink2URL: http://www-s.ti.com/sc/ds/sn74hc595.pdf

## Sheet sterownik.SchDoc: Sterownik panelu
size A4; Author: Jakub Wiczynski; Revision: 1
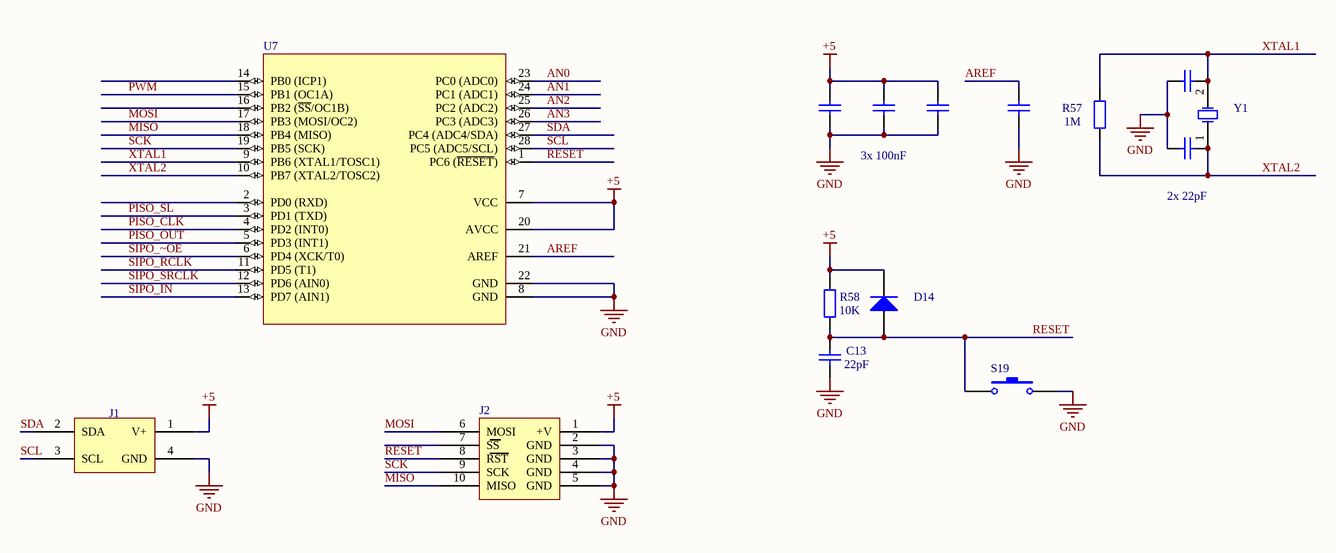
[diagram p4: sterownik.SchDoc]

### Parts
C7  http://www.tme.eu/pl/details/12061c104kat2a/kondensatory-mlcc-smd-1206/avx/  [C1206]  (value not drawn)
C8  http://www.tme.eu/pl/details/12061c104kat2a/kondensatory-mlcc-smd-1206/avx/  [C1206]  (value not drawn)
C9  http://www.tme.eu/pl/details/12061c104kat2a/kondensatory-mlcc-smd-1206/avx/  [C1206]  (value not drawn)
C10  http://www.tme.eu/pl/details/12061c104kat2a/kondensatory-mlcc-smd-1206/avx/  [C1206]  (value not drawn)
C11  http://www.tme.eu/pl/details/cl31c220jbcnnnc/kondensatory-mlcc-smd-1206/samsung/  [C1206]  (value not drawn)
C12  http://www.tme.eu/pl/details/cl31c220jbcnnnc/kondensatory-mlcc-smd-1206/samsung/  [C1206]  (value not drawn)
C13  value 22pF  [C1206]  (hidden comment: http://www.tme.eu/pl/details/cl31c220jbcnnnc/kondensatory-mlcc-smd-1206/samsung/)
D14  http://www.tme.eu/pl/details/1n4148-1206/diody-uniwersalne-smd/dc-components/cd4148w1206c/  [DIODA 1N4148]  (value not drawn)
J1  http://www.tme.eu/pl/details/p1304/zlacza-idc/tomic/  [IDC 4PIN]  (value not drawn)
J2  http://www.tme.eu/pl/details/09185106324/zlacza-idc/harting/  [IDC 10PIN]  (value not drawn)
R57  value 1M  [C1206]  (hidden comment: http://www.tme.eu/pl/details/rc1206fr-071m/rezystory-smd-1206/yageo/rc1206fr-071ml/)
R58  value 10K  [C1206]  (hidden comment: http://www.tme.eu/pl/details/crcw120610k0jntabc/rezystory-smd-1206/vishay/)
S19  http://www.tme.eu/pl/details/1301.9315/mikroprzelaczniki-tact-pcb/schurter/  [Microswitch_SMD]  (value not drawn)
U7  http://www.tme.eu/pl/details/atmega8a-au/mikrokontrolery-atmel-avr-smd/atmel/  [32A_N]  (value not drawn)
Y1  http://www.tme.eu/pl/details/16.00m-smdhc49s-ht/rezonatory-kwarcowe-smd/yic/16mhz-_105c-49smd-on-tape/  [crystal]  (value not drawn)

### Nets
+5: C7.2 C8.2 C9.2 D14.2(K) J1.1(V+) J2.1(+V) R58.2 U7.7(VCC) U7.20(AVCC)
GND: C7.1 C8.1 C9.1 C10.2 C11.1 C12.1 C13.1 J1.4(GND) J2.2(GND) J2.3(GND) J2.4(GND) J2.5(GND) S19.2 U7.8(GND) U7.22(GND)
AN0: U7.23(PC0_(ADC0))
AN1: U7.24(PC1_(ADC1))
AN2: U7.25(PC2_(ADC2))
AN3: U7.26(PC3_(ADC3))
AREF: C10.1 U7.21(AREF)
MISO: J2.10(MISO) U7.18(PB4_(MISO))
MOSI: J2.6(MOSI) U7.17(PB3_(MOSI/OC2))
PISO_CLK: U7.4(PD2_(INT0))
PISO_OUT: U7.5(PD3_(INT1))
PISO_SL: U7.3(PD1_(TXD))
PWM: U7.15(PB1_(OC1A))
RESET: C13.2 D14.1(A) J2.8(RST) R58.1 S19.1 U7.1(PC6_(~{RESET}))
SCK: J2.9(SCK) U7.19(PB5_(SCK))
SCL: J1.3(SCL) U7.28(PC5_(ADC5/SCL))
SDA: J1.2(SDA) U7.27(PC4_(ADC4/SDA))
SIPO_IN: U7.13(PD7_(AIN1))
SIPO_RCLK: U7.11(PD5_(T1))
SIPO_SRCLK: U7.12(PD6_(AIN0))
SIPO_~OE: U7.6(PD4_(XCK/T0))
XTAL1: C11.2 R57.2 U7.9(PB6_(XTAL1/TOSC1)) Y1.2(OSC2)
XTAL2: C12.2 R57.1 U7.10(PB7_(XTAL2/TOSC2)) Y1.1(OSC1)

Not connected (* = marked no-connect by the designer): J2 7(SS); U7 2(PD0_(RXD)) 14(PB0_(ICP1)) 16(PB2_(~{SS}/OC1B))

### Notes on the sheet
- 3x 100nF
- (near C12) 2x 22pF
- Title:
- Author:
- Approved by:
- Size:
- A4
- Date:
- Revision:

### Library data of the parts
C7-C10 = Cap: 100nF; Published: 8-Jun-2000; LatestRevisionDate: 17-Jul-2002; LatestRevisionNote: Re-released for DXP Platform.; PackageReference: RAD-0.3; Publisher: Altium Limited; PackageDescription: Radial Cap, Thru-Hole; 2 Leads; 0.3 in Pin Spacing; Value: 100nF
C11-C13 = Cap: 22pF; Published: 8-Jun-2000; LatestRevisionDate: 17-Jul-2002; LatestRevisionNote: Re-released for DXP Platform.; PackageReference: RAD-0.3; Publisher: Altium Limited; PackageDescription: Radial Cap, Thru-Hole; 2 Leads; 0.3 in Pin Spacing
  C11 C12: Value: 22pF
D14 = Diode 1N4148: Dioda 1N4148; Published: 8-Jun-2000; LatestRevisionDate: 17-Jul-2002; LatestRevisionNote: Re-released for DXP Platform.; DatasheetVersion: 1997; PackageReference: DO-35; Publisher: Altium Limited; PackageDescription: Diode, Axial; Body 3.8 x 1.9 mm (LxDia. max), Lead Dia. 0.53 mm (max); Code_JEDEC: DO-204-AH; ComponentLink1Description: Manufacturer Link; ComponentLink1URL: http://www.fairchildsemi.com/; ComponentLink2Description: Datasheet; ComponentLink2URL: http://www.fairchildsemi.com/ds/1N%2F1N4148.pdf
J1 = I2C: Gniazdo IDC 4PIN
J2 = SPI: Gniazdo IDC 10PIN
R57 = Res2: 1M; Published: 8-Jun-2000; LatestRevisionDate: 17-Jul-2002; LatestRevisionNote: Re-released for DXP Platform.; PackageReference: AXIAL-0.4; Publisher: Altium Limited; PackageDescription: Axial Device, Thru-Hole; 2 Leads; 0.4 in Pin Spacing
R58 = Res2: 10K; Published: 8-Jun-2000; LatestRevisionDate: 17-Jul-2002; LatestRevisionNote: Re-released for DXP Platform.; PackageReference: AXIAL-0.4; Publisher: Altium Limited; PackageDescription: Axial Device, Thru-Hole; 2 Leads; 0.4 in Pin Spacing
S19 = SW-PB: Microswitch (SPST); pin to pad: 1>0 2>1; Published: 24-Mar-1999; LatestRevisionDate: 17-Jul-2002; LatestRevisionNote: Re-released for DXP Platform.; PackageReference: SPST-2; Publisher: Altium Limited; PackageDescription: Switch; 2 Leads
U7 = ATmega8A-PU: Atmega 8A-PU; DatasheetVersion: revD, Feb-2011; PackageVersion: revB, Sep-2001; PackageReference: 28P3; PackageDescription: 28-lead (0.300"/7.62mm Wide) Plastic Dual Inline Package (PDIP); ComponentLink1Description: Manufacturer URL; ComponentLink1URL: http://www.atmel.com/; ComponentLink2Description: ATmega8A Datasheet; ComponentLink2URL: http://www.atmel.com/dyn/resources/prod_documents/doc8159.pdf; ComponentLink3Description: ATmega8A Summary; ComponentLink3URL: http://www.atmel.com/dyn/resources/prod_documents/8159S.pdf
Y1 = XTAL: Kwarc 16MHz; Published: 8-Jun-2000; LatestRevisionDate: 17-Jul-2002; LatestRevisionNote: Re-released for DXP Platform.; PackageReference: R38; Publisher: Altium Limited; PackageDescription: Crystal, Thru-Hole; 2 Leads; Body 3.1 x 8.2 mm (Dia.xH)

## Nets that join several sheets
+5: Panel (17 pins), Driving (13 pins), PISO (7 pins), SIPO (6 pins), sterownik (9 pins)
GND: Panel (19 pins), Driving (C14.1 C15.1 Q14.3), PISO (6 pins), SIPO (C3.1 C5.1 U3.8 U5.8), sterownik (15 pins)
AN0: Panel (POT1.3), sterownik (U7.23)
AN1: Panel (POT2.3), sterownik (U7.24)
AN2: Panel (6 pins), sterownik (U7.25)
AN3: Panel (6 pins), sterownik (U7.26)
IN0: Driving (R42.1), SIPO (U3.15)
IN1: Driving (R43.1), SIPO (U3.1)
IN2: Driving (R44.1), SIPO (U3.2)
IN3: Driving (R45.1), SIPO (U3.3)
IN4: Driving (R46.1), SIPO (U3.4)
IN5: Driving (R47.1), SIPO (U3.5)
IN6: Driving (R48.1), SIPO (U3.6)
IN7: Driving (R49.1), SIPO (U3.7)
IN8: Driving (R50.1), SIPO (U5.15)
IN9: Driving (R51.1), SIPO (U5.1)
IN10: Driving (R52.1), SIPO (U5.2)
IN11: Driving (R53.1), SIPO (U5.3)
IN12: Driving (R54.1), SIPO (U5.4)
LED1: Panel (R1.1), Driving (Q1.1)
LED2: Panel (R2.1), Driving (Q2.1)
LED3: Panel (R3.1), Driving (Q3.1)
LED4: Panel (R4.1), Driving (Q4.1)
LED5: Panel (R5.1), Driving (Q5.1)
LED6: Panel (R6.1), Driving (Q6.1)
LED7: Panel (R7.1), Driving (Q7.1)
LED8: Panel (R8.1), Driving (Q8.1)
LED9: Panel (R9.1), Driving (Q9.1)
LED10: Panel (R10.1), Driving (Q10.1)
LED11: Panel (R11.1), Driving (Q11.1)
LED12: Panel (R12.1), Driving (Q12.1)
LED13: Panel (R13.1), Driving (Q13.1)
OUT0: Panel (R23.2 S1.2), PISO (U1.2)
OUT1: Panel (R22.2 S2.2), PISO (U1.3)
OUT2: Panel (R21.2 S3.2), PISO (U1.4)
OUT3: Panel (R20.2 S4.2), PISO (U1.5)
OUT4: Panel (R19.2 S5.2), PISO (U1.10)
OUT5: Panel (R18.2 S6.2), PISO (U1.11)
OUT6: Panel (R17.2 S7.2), PISO (U1.12)
OUT7: Panel (R16.2 S8.2), PISO (U1.14)
OUT8: Panel (R15.2 S9.2), PISO (U2.2)
OUT9: Panel (R14.2 S10.2), PISO (U2.3)
OUT10: Panel (R27.2 S11.3), PISO (U2.4)
OUT11: Panel (R26.2 S11.1), PISO (U2.5)
OUT12: Panel (R25.2 S12.3), PISO (U2.10)
OUT13: Panel (R24.2 S12.1), PISO (U2.11)
OUT14: Panel (R28.1 S13.2), PISO (U2.12)
PISO_CLK: PISO (U1.7 U2.7), sterownik (U7.4)
PISO_OUT: PISO (U2.13), sterownik (U7.5)
PISO_SL: PISO (U1.15 U2.15), sterownik (U7.3)
PWM: Driving (R55.1), sterownik (U7.15)
SIPO_IN: SIPO (U3.14), sterownik (U7.13)
SIPO_RCLK: SIPO (U3.12 U5.12), sterownik (U7.11)
SIPO_SRCLK: SIPO (U3.11 U5.11), sterownik (U7.12)
SIPO_~OE: SIPO (U3.13 U5.13), sterownik (U7.6)
VLED: Panel (13 pins), Driving (Q14.1)